# Altium schematic sheet ioni.SchDoc: IONI Connectors
size Letter; Organization: OSURC Mars Rover; DocumentNumber: 1; Revision: 1; SheetNumber: 2; SheetTotal: 7
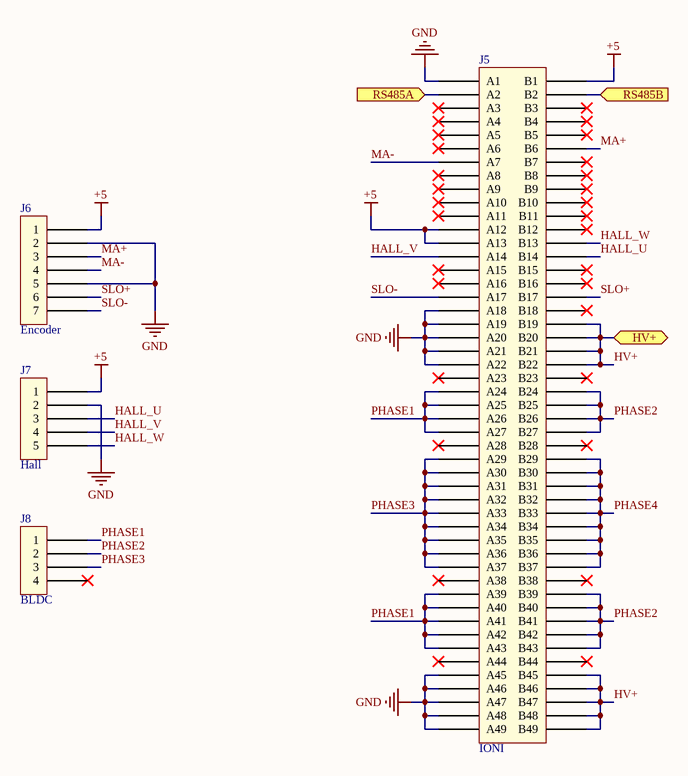
[diagram p0: ioni.SchDoc]

## Parts
J5  IONI  [PCB-9n0g0vo7nxv8tvos4xzh-1]
J6  Encoder  [PCB-c13xtdp0a1wdkl558rz9-1]
J7  Hall  [PCB-83mh4wjdb7t4rba86im5-1]
J8  BLDC  [PCB-n62yc6w6j91xslt67wd4-1]

## Ports
HV+, RS485A (in), RS485B (in)

## Nets
+5: J5.12(A12) J5.13(A13) J5.50(B1) J6.1 J7.1
GND: J5.1(A1) J5.18(A18) J5.19(A19) J5.20(A20) J5.21(A21) J5.22(A22) J5.45(A45) J5.46(A46) J5.47(A47) J5.48(A48) J5.49(A49) J6.2 J6.5 J7.2
HALL_U: J5.63(B14) J7.3
HALL_V: J5.14(A14) J7.4
HALL_W: J5.62(B13) J7.5
HV+: J5.68(B19) J5.69(B20) J5.70(B21) J5.71(B22) J5.94(B45) J5.95(B46) J5.96(B47) J5.97(B48) J5.98(B49) ; port HV+
MA+: J5.55(B6) J6.3
MA-: J5.7(A7) J6.4
PHASE1: J5.24(A24) J5.25(A25) J5.26(A26) J5.27(A27) J5.39(A39) J5.40(A40) J5.41(A41) J5.42(A42) J5.43(A43) J8.1
PHASE2: J5.73(B24) J5.74(B25) J5.75(B26) J5.76(B27) J5.88(B39) J5.89(B40) J5.90(B41) J5.91(B42) J5.92(B43) J8.2
PHASE3: J5.29(A29) J5.30(A30) J5.31(A31) J5.32(A32) J5.33(A33) J5.34(A34) J5.35(A35) J5.36(A36) J5.37(A37) J8.3
PHASE4: J5.78(B29) J5.79(B30) J5.80(B31) J5.81(B32) J5.82(B33) J5.83(B34) J5.84(B35) J5.85(B36) J5.86(B37)
RS485A: J5.2(A2) ; port RS485A
RS485B: J5.51(B2) ; port RS485B
SLO+: J5.66(B17) J6.6
SLO-: J5.17(A17) J6.7

Not connected (* = marked no-connect by the designer): J5 3(A3)* 4(A4)* 5(A5)* 6(A6)* 8(A8)* 9(A9)* 10(A10)* 11(A11)* 15(A15)* 16(A16)* 23(A23)* 28(A28)* 38(A38)* 44(A44)* 52(B3)* 53(B4)* 54(B5)* 56(B7)* 57(B8)* 58(B9)* 59(B10)* 60(B11)* 61(B12)* 64(B15)* 65(B16)* 67(B18)* 72(B23)* 77(B28)* 87(B38)* 93(B44)*; J8 4*

## Notes on the sheet
- Title
- Size:
- Date:
- Letter
- Number:
- Time:
- Revision:
- Sheet
- of
- File:

## Library data of the parts
J5 = CMP-gexh7s52tbg9y3x1n92d-1: IONI Motor Controller; CustomComponentID: gexh7s52tbg9y3x1n92d
J6 = CMP-9d2a54dfa82f42ed-1: 2.50mm (.098") Pitch Mini-Lock Wire-to-Board Header, Vertical, Friction and Positive Lock, 7 Circuits, Lead-free; Manufacturer Part Number: 0533750710; Lead-Free Status: Lead Free; Gender: Male; Octopart URL: http://octopart.com/0533750710-molex-16715875; RoHS: Compliant; Mounting Style: Solder; Packaging: Bulk; Lifecycle Status: Not Listed by Manufacturer; OctopartID: 9d2a54dfa82f42ed
J7 = CMP-1130547-3: 2.50mm Pitch Mini-LockT Wire-to-Board Header, Vertical, Friction and Positive Lock, 5 Circuits; Manufacturer Part Number: 53375-0510; Number of Contacts: 5; Gender: Male; Current Rating: 3.00 A; Glow Wire Compliant: Non-Compliant; Octopart URL: http://octopart.com/53375-0510-molex-934385; REACH SVHC Compliance: No SVHC; Orientation: Vertical; Color: White; Contact Material: Phosphor Bronze; Halogen Free Status: Not Low Halogen; Mounting Style: Through Hole; Number of Rows: 1; Number of Circuits: 5; Lifecycle Status: Active; RoHS: Compliant; Contact Plating: Tin; OctopartID: db931297bf040454
J8 = CMP-ff94357216382053-1: Mega-Fit Vert Hdr Assy 4 Ckt Tin; Manufacturer Part Number: 0768290004; Octopart URL: http://octopart.com/0768290004-molex-65850570; Lifecycle Status: Not Listed by Manufacturer; RoHS: Compliant; OctopartID: ff94357216382053